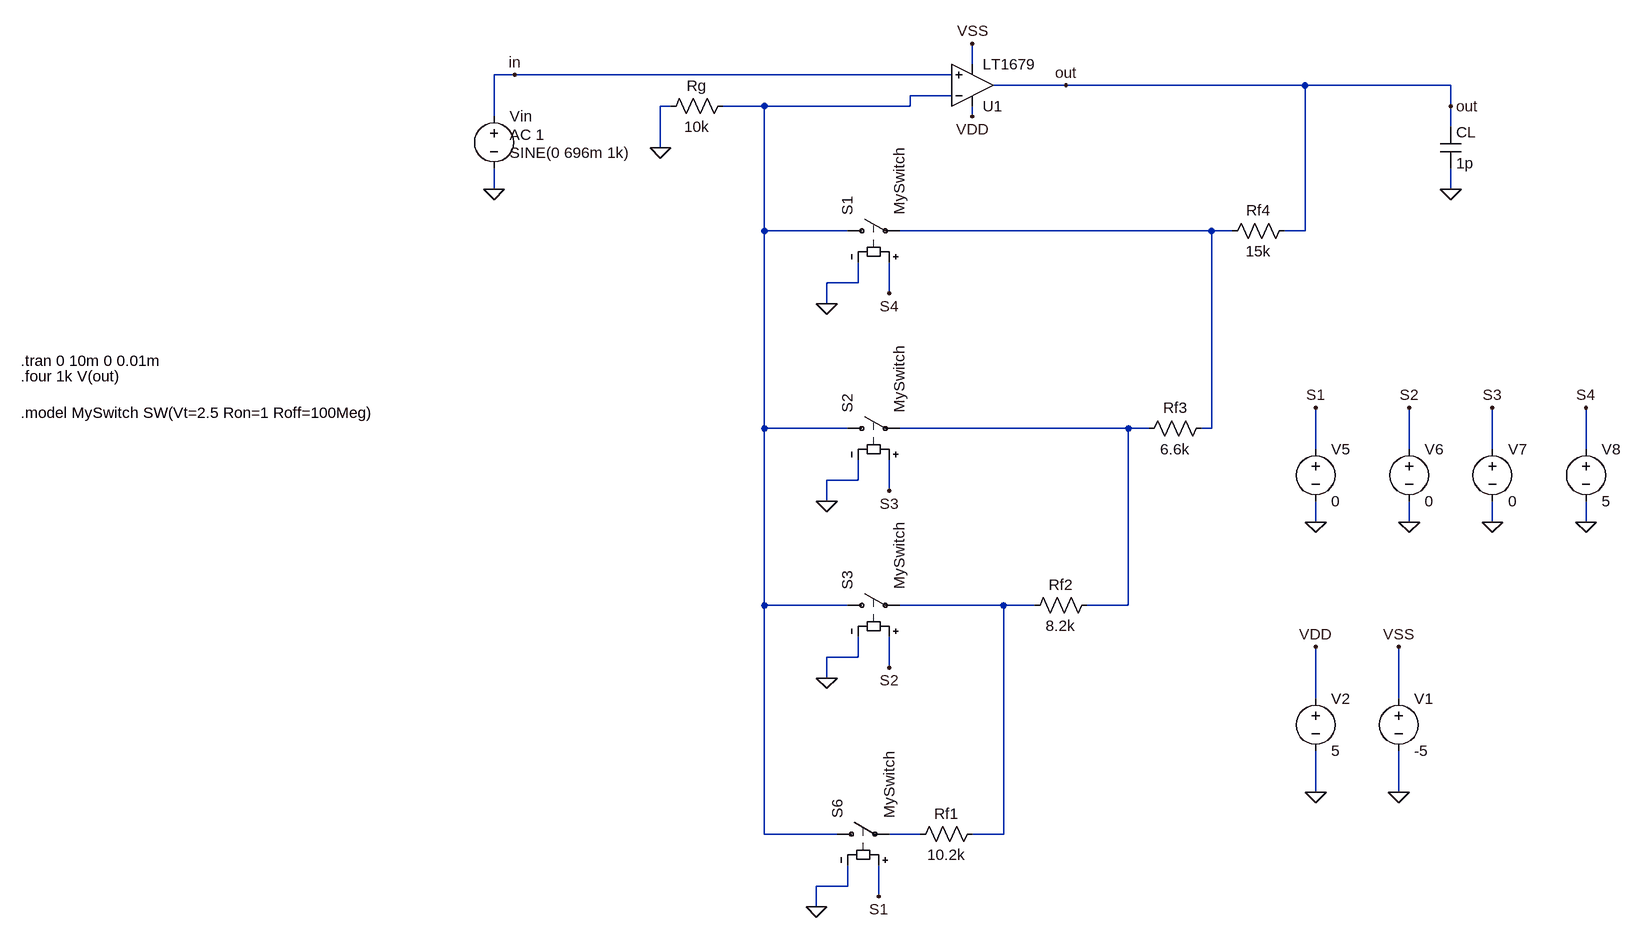
[diagram p0: schematic Etaj_3_PGA.asc]
Etaj_3_PGA.asc, the LTspice schematic file:
Version 4.1
SHEET 1 1932 2120
WIRE -192 48 -192 16
WIRE -896 64 -928 64
WIRE -224 64 -896 64
WIRE -48 80 -160 80
WIRE 320 80 -48 80
WIRE 544 80 320 80
WIRE -224 96 -288 96
WIRE -656 112 -672 112
WIRE -512 112 -576 112
WIRE -288 112 -288 96
WIRE -288 112 -512 112
WIRE 544 112 544 80
WIRE -928 128 -928 64
WIRE -192 128 -192 112
WIRE 544 144 544 112
WIRE -672 176 -672 112
WIRE -928 240 -928 208
WIRE 544 240 544 208
WIRE -512 304 -512 112
WIRE -384 304 -512 304
WIRE 176 304 -304 304
WIRE 208 304 176 304
WIRE 320 304 320 80
WIRE 320 304 288 304
WIRE -368 384 -368 352
WIRE -368 384 -416 384
WIRE -320 400 -320 352
WIRE -416 416 -416 384
WIRE -512 608 -512 304
WIRE -384 608 -512 608
WIRE 48 608 -304 608
WIRE 80 608 48 608
WIRE 176 608 176 304
WIRE 176 608 160 608
WIRE 336 640 336 576
WIRE 480 640 480 576
WIRE 608 640 608 576
WIRE 752 640 752 576
WIRE -368 688 -368 656
WIRE -368 688 -416 688
WIRE -320 704 -320 656
WIRE -416 720 -416 688
WIRE 336 752 336 720
WIRE 480 752 480 720
WIRE 608 752 608 720
WIRE 752 752 752 720
WIRE -512 880 -512 608
WIRE -384 880 -512 880
WIRE -144 880 -304 880
WIRE -96 880 -144 880
WIRE 48 880 48 608
WIRE 48 880 -16 880
WIRE -368 960 -368 928
WIRE -368 960 -416 960
WIRE -320 976 -320 928
WIRE -416 992 -416 960
WIRE 336 1024 336 944
WIRE 464 1024 464 944
WIRE 336 1168 336 1104
WIRE 464 1168 464 1104
WIRE -512 1232 -512 880
WIRE -400 1232 -512 1232
WIRE -272 1232 -320 1232
WIRE -144 1232 -144 880
WIRE -144 1232 -192 1232
WIRE -384 1312 -384 1280
WIRE -384 1312 -432 1312
WIRE -336 1328 -336 1280
WIRE -432 1344 -432 1312
FLAG 336 1168 0
FLAG 336 944 VDD
FLAG -928 240 0
FLAG -672 176 0
FLAG -48 80 out
FLAG -192 128 VDD
FLAG -192 16 VSS
FLAG 544 240 0
FLAG -896 64 in
FLAG 464 1168 0
FLAG 464 944 VSS
FLAG -336 1328 S1
FLAG -416 416 0
FLAG -320 976 S2
FLAG -416 720 0
FLAG -320 704 S3
FLAG -416 992 0
FLAG -320 400 S4
FLAG -432 1344 0
FLAG 336 752 0
FLAG 336 576 S1
FLAG 480 752 0
FLAG 480 576 S2
FLAG 608 752 0
FLAG 608 576 S3
FLAG 752 752 0
FLAG 752 576 S4
FLAG 544 112 out
SYMBOL voltage 336 1008 R0
WINDOW 123 0 0 Left 2
WINDOW 39 0 0 Left 2
SYMATTR InstName V2
SYMATTR Value 5
SYMBOL res -560 96 R90
WINDOW 0 0 56 VBottom 2
WINDOW 3 32 56 VTop 2
SYMATTR InstName Rg
SYMATTR Value 10k
SYMBOL res -176 1216 R90
WINDOW 0 0 56 VBottom 2
WINDOW 3 32 56 VTop 2
SYMATTR InstName Rf1
SYMATTR Value 10.2k
SYMBOL voltage -928 112 R0
WINDOW 123 24 44 Left 2
WINDOW 39 0 0 Left 2
WINDOW 3 24 72 Left 2
SYMATTR Value2 AC 1
SYMATTR Value SINE(0 696m 1k)
SYMATTR InstName Vin
SYMBOL res 304 288 R90
WINDOW 0 0 56 VBottom 2
WINDOW 3 32 56 VTop 2
SYMATTR InstName Rf4
SYMATTR Value 15k
SYMBOL res 176 592 R90
WINDOW 0 0 56 VBottom 2
WINDOW 3 32 56 VTop 2
SYMATTR InstName Rf3
SYMATTR Value 6.6k
SYMBOL res 0 864 R90
WINDOW 0 0 56 VBottom 2
WINDOW 3 32 56 VTop 2
SYMATTR InstName Rf2
SYMATTR Value 8.2k
SYMBOL cap 528 144 R0
SYMATTR InstName CL
SYMATTR Value 1p
SYMBOL OpAmps\\LT1679 -192 80 M180
SYMATTR InstName U1
SYMBOL voltage 464 1008 R0
WINDOW 123 0 0 Left 2
WINDOW 39 0 0 Left 2
SYMATTR InstName V1
SYMATTR Value -5
SYMBOL voltage 336 624 R0
WINDOW 123 0 0 Left 2
WINDOW 39 0 0 Left 2
SYMATTR InstName V5
SYMATTR Value 0
SYMBOL voltage 480 624 R0
WINDOW 123 0 0 Left 2
WINDOW 39 0 0 Left 2
SYMATTR InstName V6
SYMATTR Value 0
SYMBOL voltage 608 624 R0
WINDOW 123 0 0 Left 2
WINDOW 39 0 0 Left 2
SYMATTR InstName V7
SYMATTR Value 0
SYMBOL voltage 752 624 R0
WINDOW 123 0 0 Left 2
WINDOW 39 0 0 Left 2
SYMATTR InstName V8
SYMATTR Value 5
SYMBOL sw -400 304 R270
SYMATTR InstName S1
SYMATTR Value MySwitch
SYMBOL sw -416 1232 R270
SYMATTR InstName S6
SYMATTR Value MySwitch
SYMBOL sw -400 608 R270
SYMATTR InstName S2
SYMATTR Value MySwitch
SYMBOL sw -400 880 R270
SYMATTR InstName S3
SYMATTR Value MySwitch
TEXT -1656 504 Left 2 !.tran 0 10m 0 0.01m
TEXT -1656 584 Left 2 !.model MySwitch SW(Vt=2.5 Ron=1 Roff=100Meg)
TEXT -1656 528 Left 2 !.four 1k V(out)

The netlist it stands for:
* Etaj_3_PGA.asc
V2 VDD 0 5
Rg N001 0 10k
Rf1 N004 N005 10.2k
Vin in 0 SINE(0 696m 1k) AC 1
Rf4 out N002 15k
Rf3 N002 N003 6.6k
Rf2 N003 N004 8.2k
CL out 0 1p
* U1: LT1679 (symbol OpAmps\LT1679 not available, pins judged from their places): In+=in In-=N001 V+=VDD V-=VSS OUT=out
V1 VSS 0 -5
V5 S1 0 0
V6 S2 0 0
V7 S3 0 0
V8 S4 0 5
S1 N001 N002 S4 0 MySwitch
S6 N001 N005 S1 0 MySwitch
S2 N001 N003 S3 0 MySwitch
S3 N001 N004 S2 0 MySwitch
.tran 0 10m 0 0.01m
.model MySwitch SW(Vt=2.5 Ron=1 Roff=100Meg)
.four 1k V(out)
.backanno
.end